# EAGLE design jtag-stlink2-breakout (EAGLE 9.6.2)
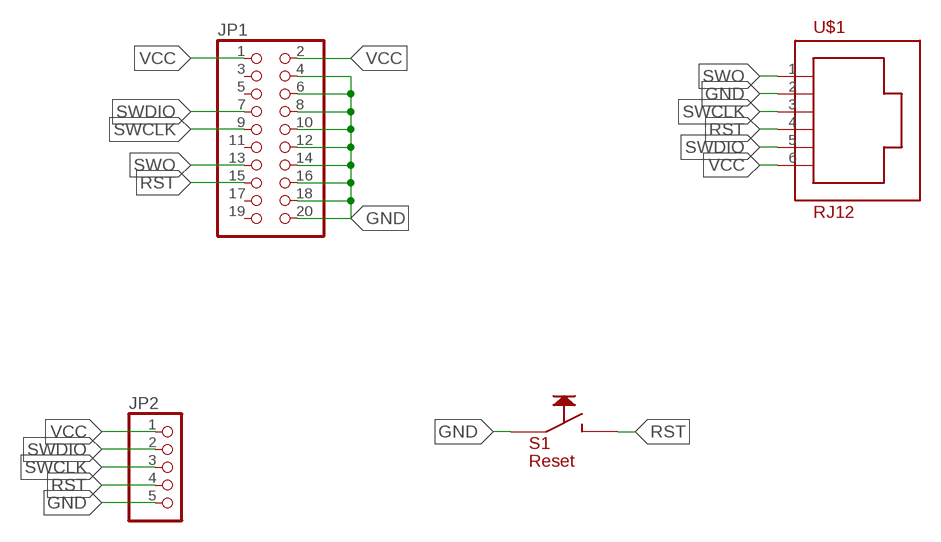
[diagram p0: schematic, sheet 1]

## Parts
JP1  PINHD-2X10  [2X10]
JP2  PINHD-1X5  [1X05]
S1  Reset  SMD-PUSH-BUTTONILS-3X6X2,5  [SMD-PUSH-BUTTON-ILS-3X6X2,5]
U$1  RJ12  [RJ12]

## Nets
GND: JP1.4 JP1.6 JP1.8 JP1.10 JP1.12 JP1.14 JP1.16 JP1.18 JP1.20 JP2.5 S1.P$1 U$1.2
RST: JP1.15 JP2.4 S1.P$2 U$1.4
SWCLK: JP1.9 JP2.3 U$1.3
SWDIO: JP1.7 JP2.2 U$1.5
SWO: JP1.13 U$1.1
VCC: JP1.1 JP1.2 JP2.1 U$1.6
Unconnected: JP1.3 JP1.5 JP1.11 JP1.17 JP1.19

## Library data of the parts
JP1 = pinhead:PINHD-2X10: PIN HEADER
JP2 = pinhead:PINHD-1X5: PIN HEADER
S1 = Mechanik:SMD-PUSH-BUTTON
U$1 = Mechanik:RJ12

## Board
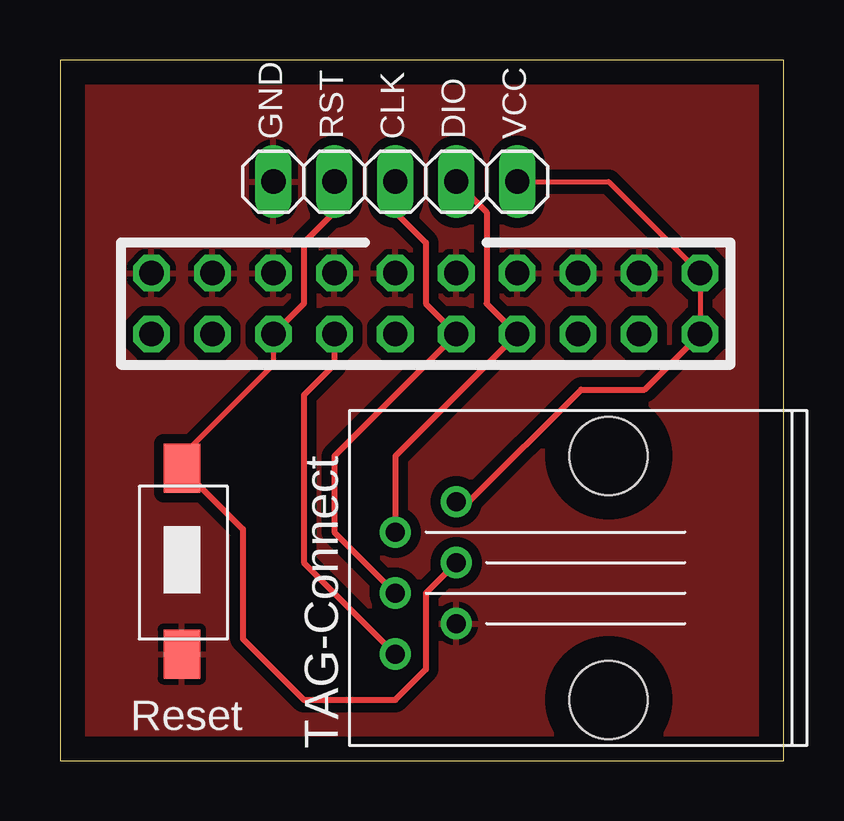
[diagram p1: board, top side]
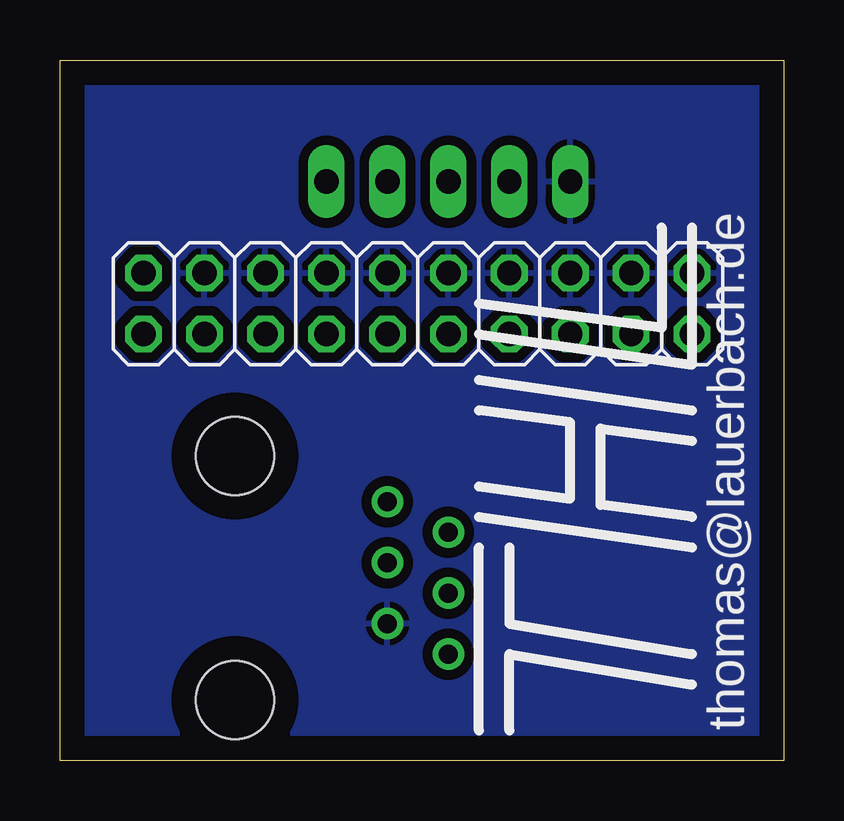
[diagram p2: board, bottom side, seen from below]

Size 30.15 x 29.2 mm. Coordinates in mm from the lower left corner, seen from the top.
Outline: 0,0 30.15,0 30.15,29.2 0,29.2 0,0
Copper layers (1*16): Top 0.035mm / dielectric 1.5mm / Bottom 0.035mm
Design rules "default": minimum track width 6mil, minimum drill 0.35mm, track to track 6mil, track to pad 6mil, pad to pad 6mil, via to via 6mil, smd to smd 6mil, copper to edge 40mil, drill to drill 6mil, minimum pad ring 10mil, minimum via ring 8mil, stop-mask expansion 4mil, vias tented up to drill 0mil, thermal gap 10mil

### Footprints (pad centres in the part's own frame; a part is rotated, then mirrored left to right if it is on the bottom)
2X10 = drill 1.016 octagon: 1 -11.43,-1.27; 2 -11.43,1.27; 3 -8.89,-1.27; 4 -8.89,1.27; 5 -6.35,-1.27; 6 -6.35,1.27; 7 -3.81,-1.27; 8 -3.81,1.27; 9 -1.27,-1.27; 10 -1.27,1.27; 11 1.27,-1.27; 12 1.27,1.27; 13 3.81,-1.27; 14 3.81,1.27; 15 6.35,-1.27; 16 6.35,1.27; 17 8.89,-1.27; 18 8.89,1.27; 19 11.43,-1.27; 20 11.43,1.27
1X05 = drill 1.016 long: 1 -5.08,0; 2 -2.54,0; 3 0,0; 4 2.54,0; 5 5.08,0
SMD-PUSH-BUTTON-ILS-3X6X2,5 = smd 2.032 x 1.524: P$1 -4.445,0; P$2 3.302,0
RJ12 = drill 0.8: 1 -8.89,-3.175; 2 -6.35,-1.905; 3 -8.89,-0.635; 4 -6.35,0.635; 5 -8.89,1.905; 6 -6.35,3.175 | hole 3.25: 0,-5.08; 0,5.08

### Placement (x,y rotation side)
JP1  15.24,19.05 0 bottom
JP2  13.97,24.13 180 top
S1  5.08,8.89 90 top
U$1  22.86,7.62 0 top
U$2  [THL]  7.62,11.43 90 bottom

### Tracks (layer width: path | path; a pad name or v marks a point on that pad's centre or on a via)
GND
  pour Top (isolate 0.406): 0,29.21 30.48,29.21 30.48,0 0,0
  pour Bottom (isolate 0.406): 0,29.21 30.48,29.21 30.48,0 0,0
RST
  Top 0.203: S1.P$2 4.83,12.45 8.89,16.51 JP1.15
  Top 0.254: U$1.4 15.24,6.99 15.24,3.81 13.97,2.54 10.16,2.54 7.62,5.08 7.62,9.65 S1.P$2 | JP2.4 11.43,22.86 10.16,21.59 10.16,19.05 JP1.15
SWCLK
  Top 0.254: U$1.3 11.43,9.53 11.43,12.7 JP1.9 15.24,19.05 15.24,21.59 13.97,22.86 JP2.3
SWDIO
  Top 0.254: U$1.5 13.97,12.7 JP1.7 17.78,19.05 17.78,22.86 JP2.2
SWO
  Top 0.254: JP1.13 11.43,16.51 10.16,15.24 10.16,8.26 U$1.1
VCC
  Top 0.203: JP2.1 22.86,24.13 JP1.2 JP1.1
  Top 0.254: JP1.1 24.36,15.47 21.71,15.47 17.04,10.79 U$1.6

### Text on the board
tPlace: GND | RST | CLK | DIO | VCC | TAG-Connect